# Altium project TLC555_1Hz_50duty_Oscillator.PrjPcb
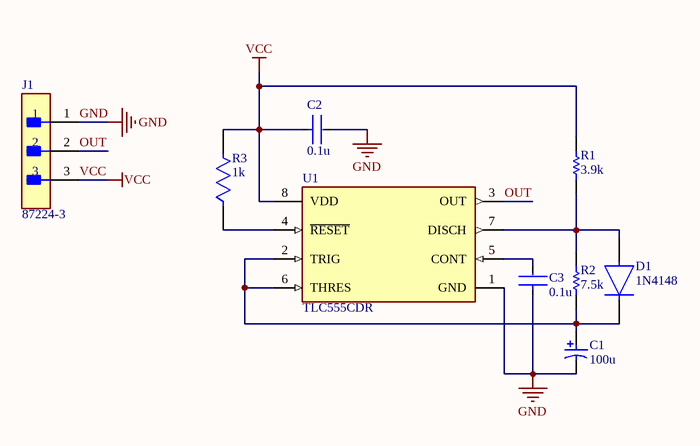
[diagram p0: Sheet1.SchDoc]
1 sheet, 9 parts. Net scope: global (net labels, ports and power ports of the same name join across sheets).
Board file: PCB1.PcbDoc

## Sheet Sheet1.SchDoc
size A4; SheetNumber: 1; SheetTotal: 1

### Parts
C1  100u  [CAPPR60-350-1150X800X1300]
C2  0.1u  [FP-CC0805-0_85-IPC_C]
C3  0.1u  [FP-CC0805-0_85-IPC_C]
D1  1N4148  [FP-017AG-MFG]
J1  87224-3  [FP-87224-3-MFG]
R1  3.9k  [RESC2013X70X40NL20T20]
R2  7.5k  [RESC2013X70X40NL20T20]
R3  1k  [FP-RC2012-IPC_B]
U1  TLC555CDR  [FP-D0008A-IPC_B]

### Nets
GND: C1.2 C2.2 C3.1 J1.1 U1.1(GND)
VCC: C2.1 J1.3 R1.2 R3.2 U1.8(VDD)
OUT: J1.2 U1.3(OUT)
NetC1_1: C1.1 D1.1(C) R2.1 U1.2(TRIG) U1.6(THRES)
NetC3_2: C3.2 U1.5(CONT)
NetD1_2: D1.2(A) R1.1 R2.2 U1.7(DISCH)
NetR3_1: R3.1 U1.4(~{RESET})

### Library data of the parts
C1 = CMP-2000-07363-1: Aluminum Electrolytic Capacitor, 100 uF, +/- 20%, 35 V, -55 to 105 degC, 2-Pin THD, RoHS, Bulk; Manufacturer: Nichicon; Voltage, Rating: 35VDC; Tolerance: -20,+20%; Configuration: Radial,Can; Capacitance: 100μF; Temperature, Operating, Minimum: -55Deg.C; Brand/Series: UPWSeries; Mounting Technology: ThroughHole; Datasheet URL: http://nichicon-us.com/english/products/pdfs/e-upw.pdf; Mounting Type: PCB; Manufacturer URL: http://www.nichicon.co.jp/english/; Material, Element: AluminumElectrolytic; Package Reference: CAPPR60-350-1150X800X1300; Package Description: 2-Pin Through Hole Device, Dia 8 mm, Body Length 11.5 mm; Case Size: 0.315In.Dia.x0.453In.L(8mmDia.x11.5mmL); Lead Spacing: 0.138In.(3.50mm)mm; Datasheet Version: 08/2015; Termination: Through-hole
C2 C3 = CMP-1036-04410-2: CAP CER 0.1UF 25V X7R 0805; Manufacturer Part Number: CC0805KRX7R8BB104; Manufacturer: Yageo; Tolerance: 0.1; Material: Ceramic; Value: 100 nF; ComponentLink2URL: http://www.yageo.com/documents/recent/UPY-GPHC_Y5V_6.3V-to-50V_8.pdf; Category: Cap; Mouser Description: Multilayer Ceramic Capacitors MLCC - SMD/SMT 100nF 25V X7R 10%; Device Class L1: Passive Components; Footprint Url: http://www.yageo.com/exep/pages/download/literatures/UPY-C_GEN_24.pdf; Height: 0.95mm; Digikey Description: CAP CER 0.1UF 25V X7R 0805; Lead Free: Yes; Temperature Range High: +85°C; Temperature: -30°C to +85°C; Ipc Land Pattern Name: CAPC200125X85; Capacitance: 100 nF; Automotive: No; Octopart: https://octopart.com/cc0805krx7r8bb104-yageo-39467766; Device Class L2: Capacitors; Temperature Characteristic: X7R; Voltage Rating: 25 V; ComponentLink2Description: Datasheet; Temperature Range Low: -30°C; Device Class L3: Ceramic Capacitors; RoHS: TRUE; Package: CC0805-0.85
D1 = CMP-07163-000046-1: DIODE GEN PURP 100V 200MA DO35; Forward Voltage: 1V; Max Power Dissipation: 500mW; Max Reverse Current: 5uA; Forward Current: 300mA; Current: 4A; Reverse Recovery Time: 4ns; Element Configuration: Single; Outside Diameter: 1.85mm; Capacitance: 4pF; Polarity: Standard; Max Forward Surge Current (Ifsm): 1A; Reverse Voltage: 100V; Output Current: 200mA; Average Rectified Current: 200mA; Diameter: 1.91mm; Max Repetitive Reverse Voltage (Vrrm): 100V; Current Rating: 200mA; Case/Package: DO-35; Lead Free: Lead Free; Number of Pins: 2; Recovery Time: 4ns; Packaging: Bulk; Contact Plating: Tin; Voltage: 100V; Mount: Through Hole; Max Surge Current: 4A; Package Quantity: 2000; Width: 1.91mm; Max Reverse Voltage (DC): 100V; Length: 4.56mm; Radiation Hardening: No; Power Dissipation: 500mW; Voltage Rating (DC): 100V; Peak Non-Repetitive Surge Current: 4A; REACH SVHC: No SVHC; Height: 4.56mm; Max Operating Temperature: 175°C; Series: -; Weight: 0.01lb; Min Operating Temperature: -65°C
J1 = CMP-2000-05697-2: CONN HEADER VERT 3POS 2.54MM; Number of Positions: 3; Gasket: No (Without); High Speed Serial Data Connector: No; Current Rating: 3A; Contact Post Length: 0.125inch; PCB Thickness: 1.397mm; PCB Mount Retention: Without; Connector Type: Plug; Approvals: CSA; PCB Mounting Orientation: Vertical; Pitch: 2.54mm; Mating Alignment: No (Without); Housing Color: Black; Contact Gender: Male; Length: 7.21mm; Max Operating Temperature: 105°C; Strain Relief: No (Without); Contact Material: Bronze; Row Spacing: 2.54mm; Series: AMPMODU MOD II; Board Standoff: No (Without); Package Quantity: 520; Radiation Hardening: No; Contact Protection: No (Without); Stabilizers: No (Without); Number of Rows: 1; Contact Mating Length: 8.08mm; Contact Shape: Square; Depth: 2.54mm; Contact Current Rating: 3A; Flammability Rating: UL94 V-0; Packaging: Carton; Number of Contacts: 3; Orientation: Straight; Mount: Through Hole; Keyed: No; Contact Type: Male Pin; Housing Material: Thermoplastic; High Temperature Housing: No; ELV: Compliant; Contact Plating: Gold; Termination: Through Hole; Selectively Loaded: No (Without); Lead Free: Lead Free; Min Operating Temperature: -65°C; Mating Connector Lock: No (Without); Color: Black; RoHS Compliant: Yes
R1 = CMP-2001-00541-1: Manufacturer: Panasonic; Part Number: ERJ6ENF3901V
R2 = CMP-2001-00289-1: Manufacturer: Panasonic; Part Number: ERJ-6ENF7501V
R3 = CMP-13261-003265-1: Res Thick Film 0805 1kΩ 1% 0.125W ±100ppm/°C Molded SMD T/R; Max Power Dissipation: 125mW; Resistance: 1kR; Voltage Rating (DC): 150V; Height: 0.024inch; Military Standard: Not; Min Operating Temperature: -55°C; Composition: Thick Film; Case Code (Metric): 2012; Lead Free: Lead Free; Contact Plating: Tin; Max Operating Temperature: 155°C; Case/Package: 0805; Case Code (Imperial): 0805; Radiation Hardening: No; Width: 0.049inch; Number of Terminations: 2; Tolerance: 1%; Features: Moisture Resistant; Packaging: Tape and Reel; Temperature Coefficient: 100ppm/°C; Length: 0.079inch; Depth: 1.25mm
U1 = CMP-04857-000001-1: IC OSC SGL TIMER 2.1MHZ 8-SOIC; Min Supply Voltage: 2V; Number of Channels: 1; Max Power Dissipation: 725mW; Max Supply Voltage: 15V; Low Level Output Current: 100mA; Current Rating: 250A; Quiescent Current: 250uA; Operating Supply Current: 360uA; High Level Output Current: -10mA; Width: 3.91mm; Case/Package: SOIC; Weight: 0.002561oz; Frequency: 2.1MHz; Height: 1.58mm; Package Quantity: 2500; REACH SVHC: No SVHC; Number of Timers/Counters: 1; Lead Free: Lead Free; Number of Pins: 8; Max Operating Temperature: 125°C; Min Operating Temperature: -40°C; Length: 4.9mm; Radiation Hardening: No; Packaging: Tape and Reel; Termination: SMD/SMT; Mount: Surface Mount; Power Dissipation: 725mW